# Altium schematic sheet ADCConvert.SchDoc
size B
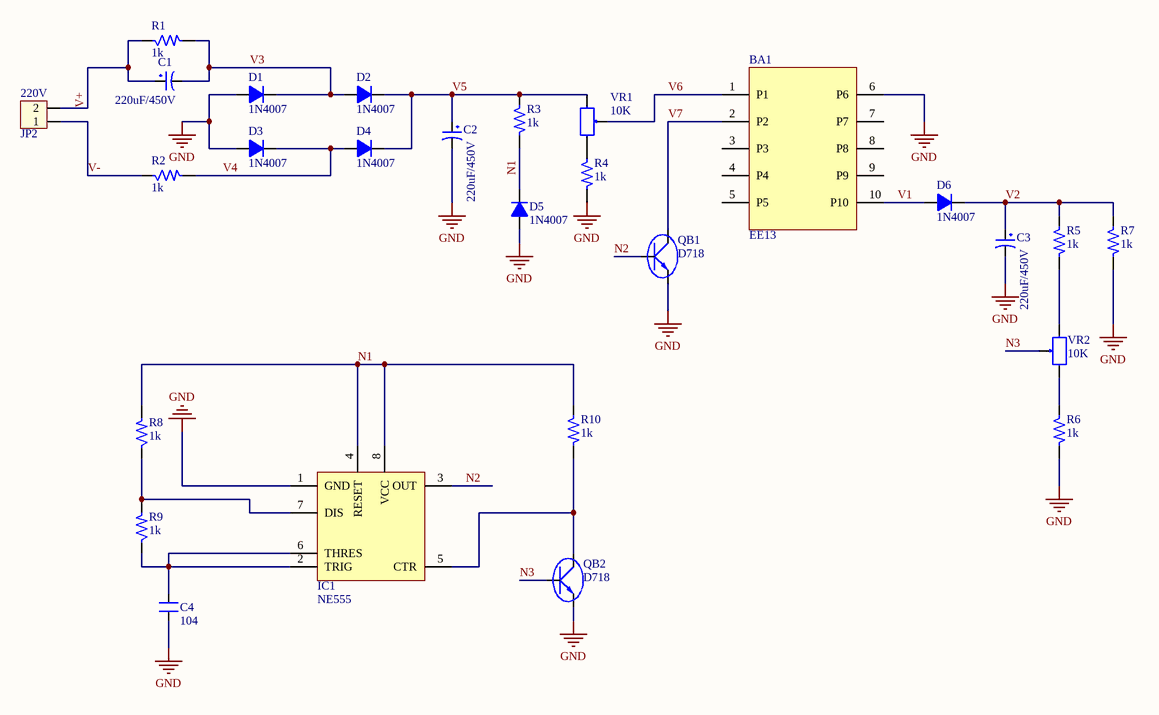
[diagram p0: ADCConvert.SchDoc]

## Parts
220V  JP2  [CON2]
BA1  EE13  [EE1BA]
C1  220uF/450V  [CP1/2]
C2  220uF/450V  [CP1.5/3.4]
C3  220uF/450V  [CP1.5/3.4]
C4  104  [CP1/2]
D1  1N4007  [D1A]
D2  1N4007  [D1A]
D3  1N4007  [D1A]
D4  1N4007  [D1A]
D5  1N4007  [D1A]
D6  1N4007  [D1A]
IC1  NE555  [DIP8/W0.3K]
QB1  D718  [QTO-220T]
QB2  D718  [QTO-220T]
R1  1k  [R1/2W]
R2  1k  [R1/2W]
R3  1k  [R1/2W]
R4  1k  [R1/2W]
R5  1k  [R1/2W]
R6  1k  [R1/2W]
R7  1k  [R1/2W]
R8  1k  [R1/2W]
R9  1k  [R1/2W]
R10  1k  [R1/2W]
VR1  10K  [VR]
VR2  10K  [VR]

## Nets
GND: BA1.6(P6) C2.2 C3.2 C4.1 D1.1(A) D3.1(A) D5.1(A) IC1.1(GND) QB1.3(E) QB2.3(E) R4.2 R6.2 R7.2
N1: D5.2(K) IC1.4(RESET) IC1.8(VCC) R3.2 R8.2 R10.1
N2: IC1.3(OUT) QB1.1(B)
N3: QB2.1(B) VR2.2
V1: BA1.10(P10) D6.1(A)
V2: C3.1 D6.2(K) R5.1 R7.1
V3: C1.2 D1.2(K) D2.1(A) R1.2
V4: D3.2(K) D4.1(A) R2.2
V5: C2.1 D2.2(K) D4.2(K) R3.1 VR1.1
V6: BA1.1(P1) VR1.2
V7: BA1.2(P2) QB1.2(C)
V+: 220V.2 C1.1 R1.1
V-: 220V.1 R2.1
NetC4_2: C4.2 IC1.2(TRIG) IC1.6(THRES) R9.1
NetIC1_5: IC1.5(CTR) QB2.2(C) R10.2
NetIC1_7: IC1.7(DIS) R8.1 R9.2
NetR4_1: R4.1 VR1.3
NetR5_2: R5.2 VR2.3
NetR6_1: R6.1 VR2.1

Not connected (* = marked no-connect by the designer): BA1 3(P3) 4(P4) 5(P5) 7(P7) 8(P8) 9(P9)

## Library data of the parts
220V = Con2: Connector 2; Value: Connector 2
BA1 = EE13-Tranformer
C1-C3 = CP9: Cap 10000uF/63V; Value: 220uF/450V
C4 = CN2: Cap np 104 => 105pF; Value: 0.1uF
D1-D6 = D1A: Diode 1A; Value: 1N4007
QB1 QB2 = D718: Transistor Power Supply; Value: D718
R1-R10 = R: Resistor 1/4W; Value: R1/4W - 1K
VR1 VR2 = VR: Var Resistor; Value: VR 10K